# Altium schematic sheet blds.SchDoc
size A2
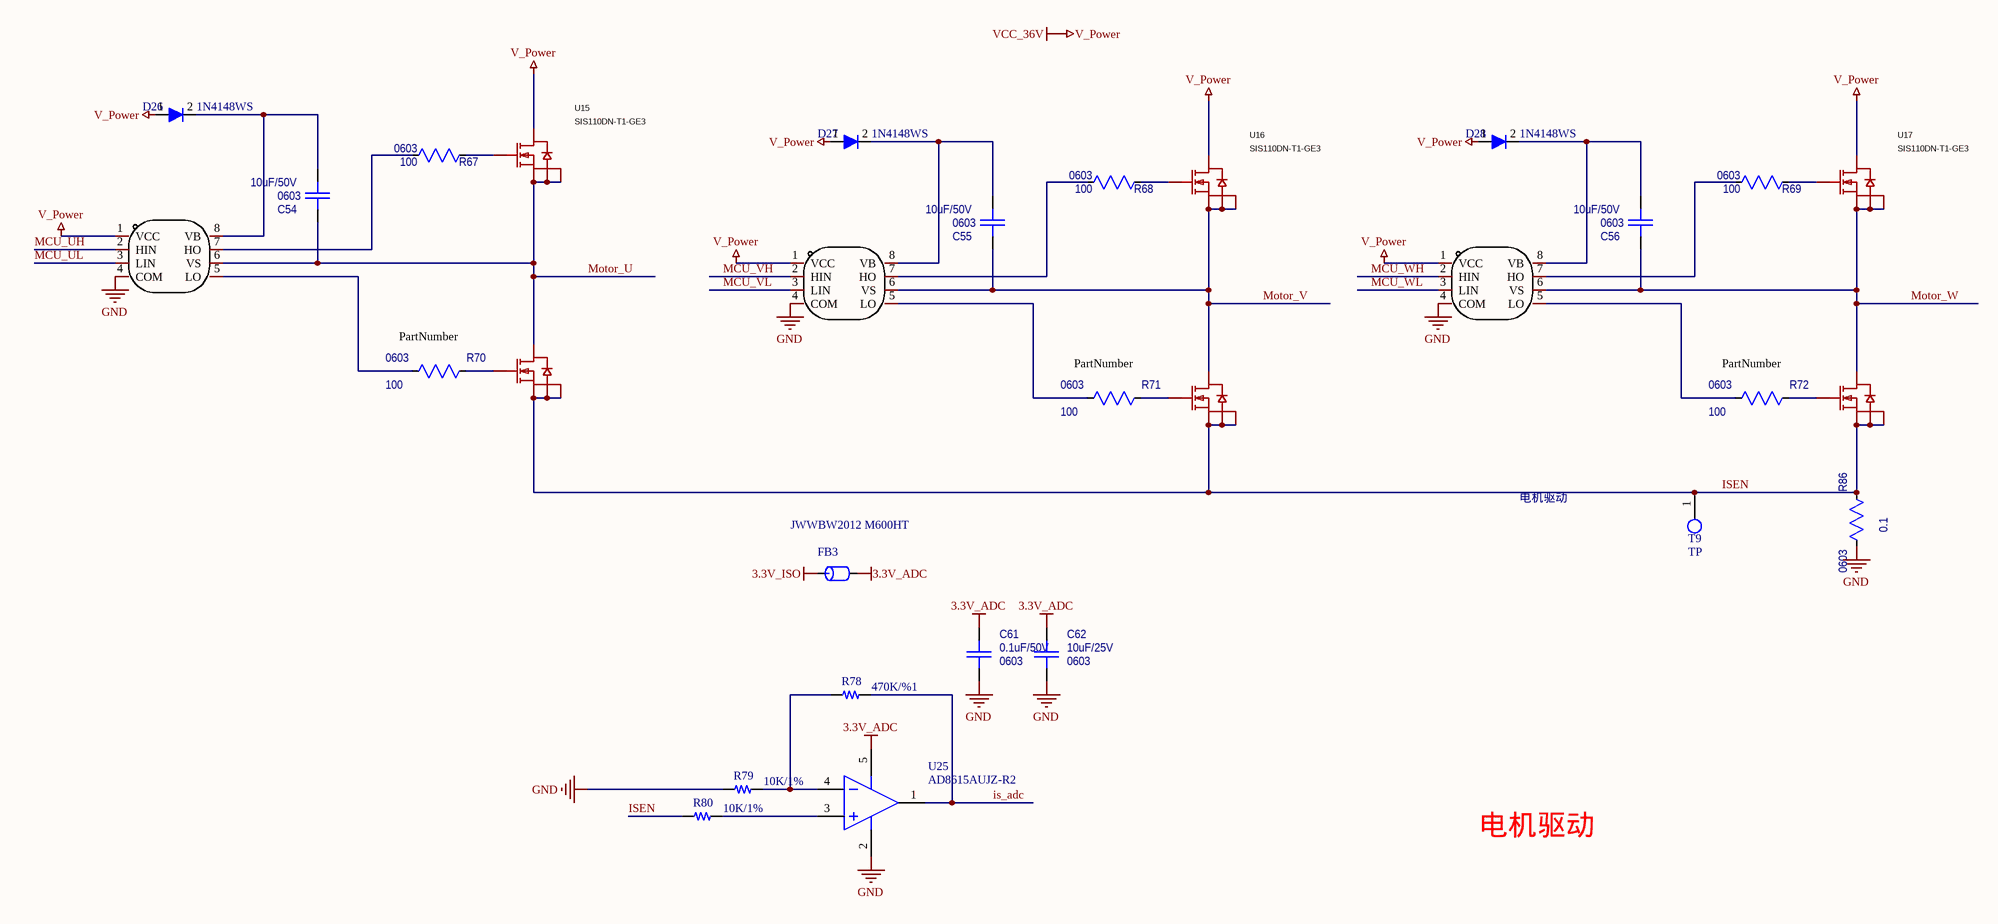
[diagram p0: blds.SchDoc]

## Parts
C54  10uF/50V  Package: 0603  [CAPC1608X092N_0603]
C55  10uF/50V  Package: 0603  [CAPC1608X092N_0603]
C56  10uF/50V  Package: 0603  [CAPC1608X092N_0603]
C61  value 0.1uF/50V  Package: 0603  [CAPC1608X092N_0603]  (hidden comment: Capacitor_0603)
C62  value 10uF/25V  Package: 0603  [CAPC1608X092N_0603]  (hidden comment: Capacitor_0603)
D26  1N4148WS  [SOD323]
D27  1N4148WS  [SOD323]
D28  1N4148WS  [SOD323]
FB3  JWWBW2012 M600HT  [0805R]
R67  value 100  Package: 0603  [RESC1608X055N_0603]  (hidden comment: Resistor_0603)
R68  value 100  Package: 0603  [RESC1608X055N_0603]  (hidden comment: Resistor_0603)
R69  value 100  Package: 0603  [RESC1608X055N_0603]  (hidden comment: Resistor_0603)
R70  value 100  Package: 0603  [RESC1608X055N_0603]  (hidden comment: Resistor_0603)
R71  value 100  Package: 0603  [RESC1608X055N_0603]  (hidden comment: Resistor_0603)
R72  value 100  Package: 0603  [RESC1608X055N_0603]  (hidden comment: Resistor_0603)
R78  value 470K/%1  [0603R]
R79  value 10K/1%  [0603R]
R80  value 10K/1%  [0603R]
R86  Package: 0603  [2010R]  (hidden comment: 0.1)
T9  TP  [TPD]
U15  SIS110DN-T1-GE3  [DFN-8_L3.3-W3.3-P0.65-BL-2]
U16  SIS110DN-T1-GE3  [DFN-8_L3.3-W3.3-P0.65-BL-2]
U17  SIS110DN-T1-GE3  [DFN-8_L3.3-W3.3-P0.65-BL-2]
U18  IRS21867STRPBF  [SO-8]  (value not drawn)
U19  IRS21867STRPBF  [SO-8]  (value not drawn)
U20  IRS21867STRPBF  [SO-8]  (value not drawn)
U21  SIS110DN-T1-GE3  [DFN-8_L3.3-W3.3-P0.65-BL-2]  (value not drawn)
U22  SIS110DN-T1-GE3  [DFN-8_L3.3-W3.3-P0.65-BL-2]  (value not drawn)
U23  SIS110DN-T1-GE3  [DFN-8_L3.3-W3.3-P0.65-BL-2]  (value not drawn)
U25  AD8615AUJZ-R2  [sot-23-5]

## Nets
3.3V_ADC: C61.1 C62.1 FB3.2 U25.5(VCC)
3.3V_ISO: FB3.1
GND: C61.2 C62.2 R79.2 R86.1 U18.4(COM) U19.4(COM) U20.4(COM) U25.2(G)
V_Power: D26.1(K) D27.1(K) D28.1(K) U15.5(D) U16.5(D) U17.5(D) U18.1(VCC) U19.1(VCC) U20.1(VCC)  [also labelled VCC_36V]
is_adc: R78.1 U25.1(OS_NUL)
ISEN: R80.2 R86.2 T9.1 U21.1(S) U21.2(S) U21.3(S) U22.1(S) U22.2(S) U22.3(S) U23.1(S) U23.2(S) U23.3(S)
MCU_UH: U18.2(HIN)
MCU_UL: U18.3(LIN)
MCU_VH: U19.2(HIN)
MCU_VL: U19.3(LIN)
MCU_WH: U20.2(HIN)
MCU_WL: U20.3(LIN)
Motor_U: C54.1 U15.1(S) U15.2(S) U15.3(S) U18.6(VS) U21.5(D)
Motor_V: C55.1 U16.1(S) U16.2(S) U16.3(S) U19.6(VS) U22.5(D)
Motor_W: C56.1 U17.1(S) U17.2(S) U17.3(S) U20.6(VS) U23.5(D)
NetC54_2: C54.2 D26.2(A) U18.8(VB)
NetC55_2: C55.2 D27.2(A) U19.8(VB)
NetC56_2: C56.2 D28.2(A) U20.8(VB)
NetR67_1: R67.1 U18.7(HO)
NetR67_2: R67.2 U15.4(G)
NetR68_1: R68.1 U19.7(HO)
NetR68_2: R68.2 U16.4(G)
NetR69_1: R69.1 U20.7(HO)
NetR69_2: R69.2 U17.4(G)
NetR70_1: R70.1 U18.5(LO)
NetR70_2: R70.2 U21.4(G)
NetR71_1: R71.1 U19.5(LO)
NetR71_2: R71.2 U22.4(G)
NetR72_1: R72.1 U20.5(LO)
NetR72_2: R72.2 U23.4(G)
NetR78_2: R78.2 R79.1 U25.4(V-)
NetR80_1: R80.1 U25.3(V+)

## Notes on the sheet
- (near R70) PartNumber
- (near R71) PartNumber
- (near R72) PartNumber
- 电机驱动

## Library data of the parts
C54-C56 = Capacitor_0603: Capacitor, MLCC; Manufacturer: muRata; PartNumber: GQM2195C2E4R7CB12J; Tolerance: [tol]; TempCo: [tempco]; Voltage Rating: [voltage]; Value: 4.7pF; ComponentLink1URL: *; Current Rating: *; ComponentLink1Description: Datasheet; Power Rating: *; SupplierDescription: CAP CER 1nF 50V X7R 0603
C61 C62 = Capacitor_0603: PartNumber: C0603C104M5RACTU; Tolerance: [tol]; TempCo: [tempco]; Voltage Rating: [voltage]; Supplier 1: *; Supplier Part Number 1: *; SupplierDescription: CAP CER 0.1UF 50V X7R 0603
D26-D28 = LL4148: 版本: V1.00; 名称: 快速开关二极管; 物料编号: APLLY; 制造商: VISHAY; Value: LL4148
FB3 = FB: Part Field 1: 磁珠/0603/1K ohm/100MHz; FB: BLM18BD102SN1(muRata); Text Field1: FB
R67-R72 R86 = Resistor_0603: Resistor, Standard; Manufacturer: Yageo; PartNumber: RC0603FR-0710KL; Power Rating: [power]; TempCo: [tempco]; Tolerance: tol; ComponentLink1URL: *; ComponentLink1Description: Datasheet; SupplierDescription: RES SMD 10K OHM 1% 1/10W 0603
  R86: Value: 0.1
R78-R80 = R
U15-U17 U21-U23 = SIS110DN-T1-GE3: Manufacturer: VISHAY(威世); Add into BOM: yes; Symbol: SIS110DN-T1-GE3; Device: SIS110DN-T1-GE3; LCSC Part Name: SIS110DN-T1-GE3; Supplier Part: C5334354; Manufacturer Part: SIS110DN-T1-GE3; Supplier Footprint: SO-8; JLCPCB Part Class: Extended Part; Datasheet: https://atta.szlcsc.com/upload/public/pdf/source/20221230/028E61738915F263ABF2615161A8D7B6.pdf; Supplier: LCSC; Convert to PCB: yes
U18-U20 = IRS21867STRPBF: Manufacturer: Infineon(英飞凌); Add into BOM: yes; Driven Configuration: 半桥; Load Type: MOSFET；IGBT; Number of Drivers: 2; Peak Output Current(sink): 4A; Supply Voltage: 10V~20V; Rise Time: 22ns; Fall Time: 18ns; Symbol: IRS21867STRPBF; Device: IRS21867STRPBF; LCSC Part Name: IRS21867STRPBF; Supplier Part: C52290; Manufacturer Part: IRS21867STRPBF; Supplier Footprint: SOIC-8; JLCPCB Part Class: Extended Part; Datasheet: https://atta.szlcsc.com/upload/public/pdf/source/20161024/1477287953380.pdf; Supplier: LCSC; Convert to PCB: yes; Peak Output Current(source): 4A; Operating Temperature: -40℃~+150℃@(Tj)
U25 = AD8615: Value: AD8615AUJZ-R2